# Altium schematic sheet Connectors_2.SchDoc
size A4; DrawnBy: Emile Renaud; Revision: V1.0; SheetNumber: 8; SheetTotal: 8
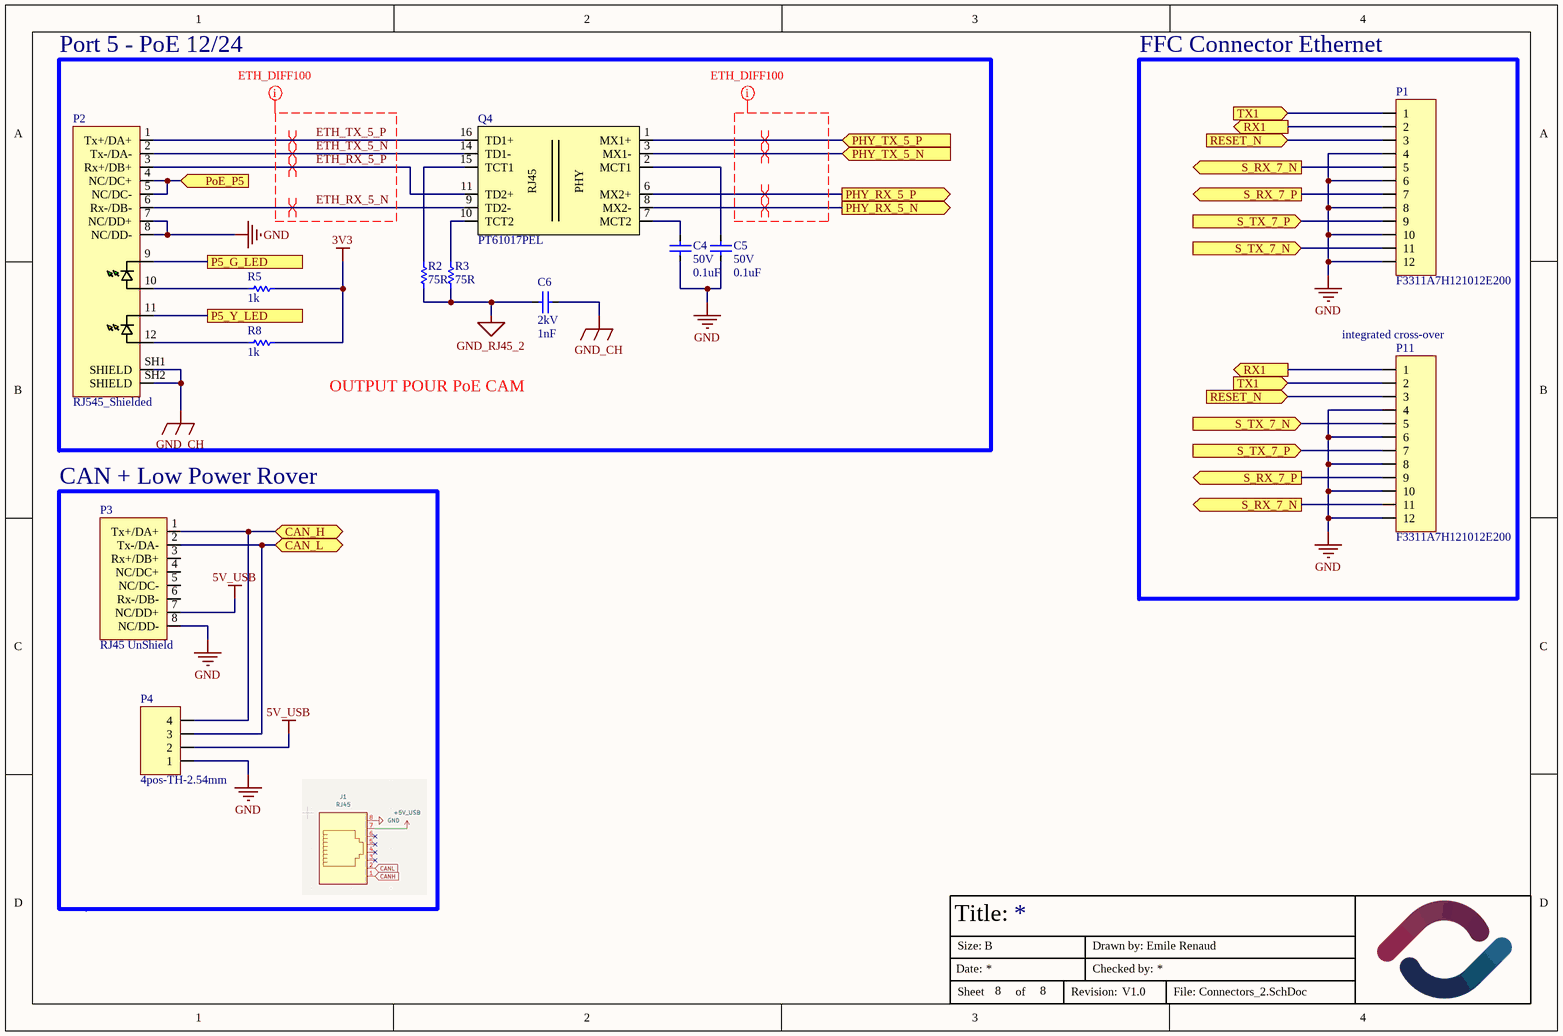
[diagram p0: Connectors_2.SchDoc]

## Parts
C4  value 0.1uF  Volt: 50V  [CAPACITOR-0603]  (hidden comment: Capacitor-0603-0.1uF-50V-X7R)
C5  value 0.1uF  Volt: 50V  [CAPACITOR-0603]  (hidden comment: Capacitor-0603-0.1uF-50V-X7R)
C6  value 1nF  Volt: 2kV  [CAPACITOR-1206]  (hidden comment: Capacitor-1206-1nF-2kV-X7R)
P1  F3311A7H121012E200  [AMPHENOL_F3311A7H121012E200]
P2  RJ545_Shielded  [ADAMTECH_MTJ-88ARX1-FSM-LG]
P3  RJ45 UnShield  [AMPHENOL_54602-908LF]
P4  4pos-TH-2.54mm  [HDR1X4]
P11  F3311A7H121012E200  [AMPHENOL_F3311A7H121012E200]
Q4  PT61017PEL  [SOIC_PT61017PEL]
R2  value 75R  [Resistor-0603]  (hidden comment: SMT resistor)
R3  value 75R  [Resistor-0603]  (hidden comment: SMT resistor)
R5  value 1k  [Resistor-0603]  (hidden comment: SMT resistor)
R8  value 1k  [Resistor-0603]  (hidden comment: SMT resistor)

## Blocks framed on the sheet
Port 5 - PoE 12/24: C4-C6 P2 Q4 R2 R3 R5 R8
FFC Connector Ethernet: P1 P11
CAN + Low Power Rover: P3 P4

## Ports
CAN_H (bidir), CAN_L (bidir), P5_G_LED, P5_Y_LED, PHY_RX_5_N (out), PHY_RX_5_P (out), PHY_TX_5_N (in), PHY_TX_5_P (in), PoE_P5 (in), RESET_N (in), RX1 (out), S_RX_7_N (out), S_RX_7_P (out), S_TX_7_N (in), S_TX_7_P (in), TX1 (in)

## Nets
3V3: R5.1 R8.1
5V_USB: P3.7(NC/DD+) P4.2
GND: C4.1 C5.1 P1.4 P1.6 P1.8 P1.10 P1.12 P2.7(NC/DD+) P2.8(NC/DD-) P3.8(NC/DD-) P4.1 P11.4 P11.6 P11.8 P11.10 P11.12
GND_CH: C6.2 P2.SH1(SHIELD) P2.SH2(SHIELD)
GND_RJ45_2: C6.1 R2.1 R3.1
CAN_H: P3.1(Tx+/DA+) P4.4 ; port CAN_H
CAN_L: P3.2(Tx-/DA-) P4.3 ; port CAN_L
ETH_RX_5_N: P2.6(Rx-/DB-) Q4.9(TD2-)
ETH_RX_5_P: P2.3(Rx+/DB+) Q4.11(TD2+)
ETH_TX_5_N: P2.2(Tx-/DA-) Q4.14(TD1-)
ETH_TX_5_P: P2.1(Tx+/DA+) Q4.16(TD1+)
P5_G_LED: P2.9 ; port P5_G_LED
P5_Y_LED: P2.11 ; port P5_Y_LED
PHY_RX_5_N: Q4.8(MX2-) ; port PHY_RX_5_N
PHY_RX_5_P: Q4.6(MX2+) ; port PHY_RX_5_P
PHY_TX_5_N: Q4.3(MX1-) ; port PHY_TX_5_N
PHY_TX_5_P: Q4.1(MX1+) ; port PHY_TX_5_P
PoE_P5: P2.4(NC/DC+) P2.5(NC/DC-) ; port PoE_P5
RESET_N: P1.3 P11.3 ; port RESET_N
RX1: P1.2 P11.1 ; port RX1
S_RX_7_N: P1.5 P11.11 ; port S_RX_7_N
S_RX_7_P: P1.7 P11.9 ; port S_RX_7_P
S_TX_7_N: P1.11 P11.5 ; port S_TX_7_N
S_TX_7_P: P1.9 P11.7 ; port S_TX_7_P
TX1: P1.1 P11.2 ; port TX1
NetC4_2: C4.2 Q4.7(MCT2)
NetC5_2: C5.2 Q4.2(MCT1)
NetP2_10: P2.10 R5.2
NetP2_12: P2.12 R8.2
NetQ4_10: Q4.10(TCT2) R3.2
NetQ4_15: Q4.15(TCT1) R2.2

Not connected (* = marked no-connect by the designer): P3 3(Rx+/DB+) 4(NC/DC+) 5(NC/DC-) 6(Rx-/DB-)

## Layout directives
net class MDI_DIFF100: (no net found under the mark), ETH_RX_5_N, ETH_RX_5_P, ETH_TX_5_N, ETH_TX_5_P
differential pair: ETH_RX_5_N, ETH_RX_5_P, ETH_TX_5_N, ETH_TX_5_P, PHY_RX_5_N, PHY_RX_5_P, PHY_TX_5_N, PHY_TX_5_P

## Notes on the sheet
- (near P11) integrated cross-over
- OUTPUT POUR PoE CAM
- Title:
- Date:
- Size:
- B
- Drawn by:
- Checked by:
- Sheet
- of
- Revision:
- File:
- (in symbol PT61017PEL) RJ45; PHY

## Library data of the parts
C4 C5 = Capacitor-0603-0.1uF-50V-X7R: Precision: X7R-10%; Package / Case: Metric 1608, EIA 0603; Mounted: Yes; Supplier 1: Digi-Key; Supplier Part Number 1: 1276-1935-2-ND; Supplier 2: Digi-Key; Supplier Part Number 2: 1276-1934-2-ND
C6 = Capacitor-1206-1nF-2kV-X7R: Precision: X7R-10%; Package / Case: Metric 3216, EIA 1206; Mounted: Yes; Supplier 1: Digi-Key; Supplier Part Number 1: 399-C1206C102KGRAC7800CT-ND; Supplier 2: Digi-Key
P1 P11 = FFC-12P-0.5MM-R/A: CONN FFC FPC 12POS 0.5MM R/A; Volt: 50V; Supplier 1: Digi-Key; Supplier Part Number 1: 609-F3311A7H121012E200CT-ND; Mounted: Yes; Package / Case: SMD
P2 = RJ545_Shielded: Jack Modular Connector 8p8c (RJ45, Ethernet) 90° Angle (Right) Shielded with LEDs; Supplier 1: Digikey; Supplier Part Number 1: 2057-MTJ-88ARX1-FSM-LG-ND; Mounted: Yes; Package / Case: SMD; Volt: N/A; HelpURL: https://app.adam-tech.com/products/download/data_sheet/203879/mtj-88arx1-fsm-lg-data-sheet.pdf
P3 = RJ545: Jack Modular Connector 8p8c (RJ45, Ethernet) 90° Angle (Right) Unshielded Cat3; Supplier 1: Digikey; Supplier Part Number 1: 609-1046-ND; Mounted: Yes; Package / Case: SMD; Volt: N/A; HelpURL: https://cdn.amphenol-cs.com/media/wysiwyg/files/drawing/c-bmj-0102.pdf
P4 = 4pos-TH-2.54mm: 4pos TH 2.54mm Header; Supplier 1: Digi-Key; Supplier Part Number 1: N/A; Mounted: Yes; Package / Case: TH; Volt: N/A
Q4 = PT61017PEL: 350µH LAN 10/100 Base-T Pulse Transformer 1CT:1CT Surface Mount; Supplier 1: Digi-Key; Supplier Part Number 1: PT61017PELCT-ND; Mounted: Yes
R2 R3 = Resistor-0603-75R: Resistor0603-75R; Precision: 1%; Watt: 0.1W; Mounted: Yes; Package / Case: Metric 1608, EIA 0603; Supplier 1: Digi-Key; Supplier Part Number 1: 311-75.0HRCT-ND
R5 R8 = Resistor-0603-1k: Resistor0603-1k; Precision: 1%; Watt: 0.1W; Mounted: Yes; Package / Case: Metric 1608, EIA 0603; Supplier 1: Digi-Key; Supplier Part Number 1: 311-1.00KHRCT-ND